# EAGLE design MAX1555_breakout (EAGLE 5.06)
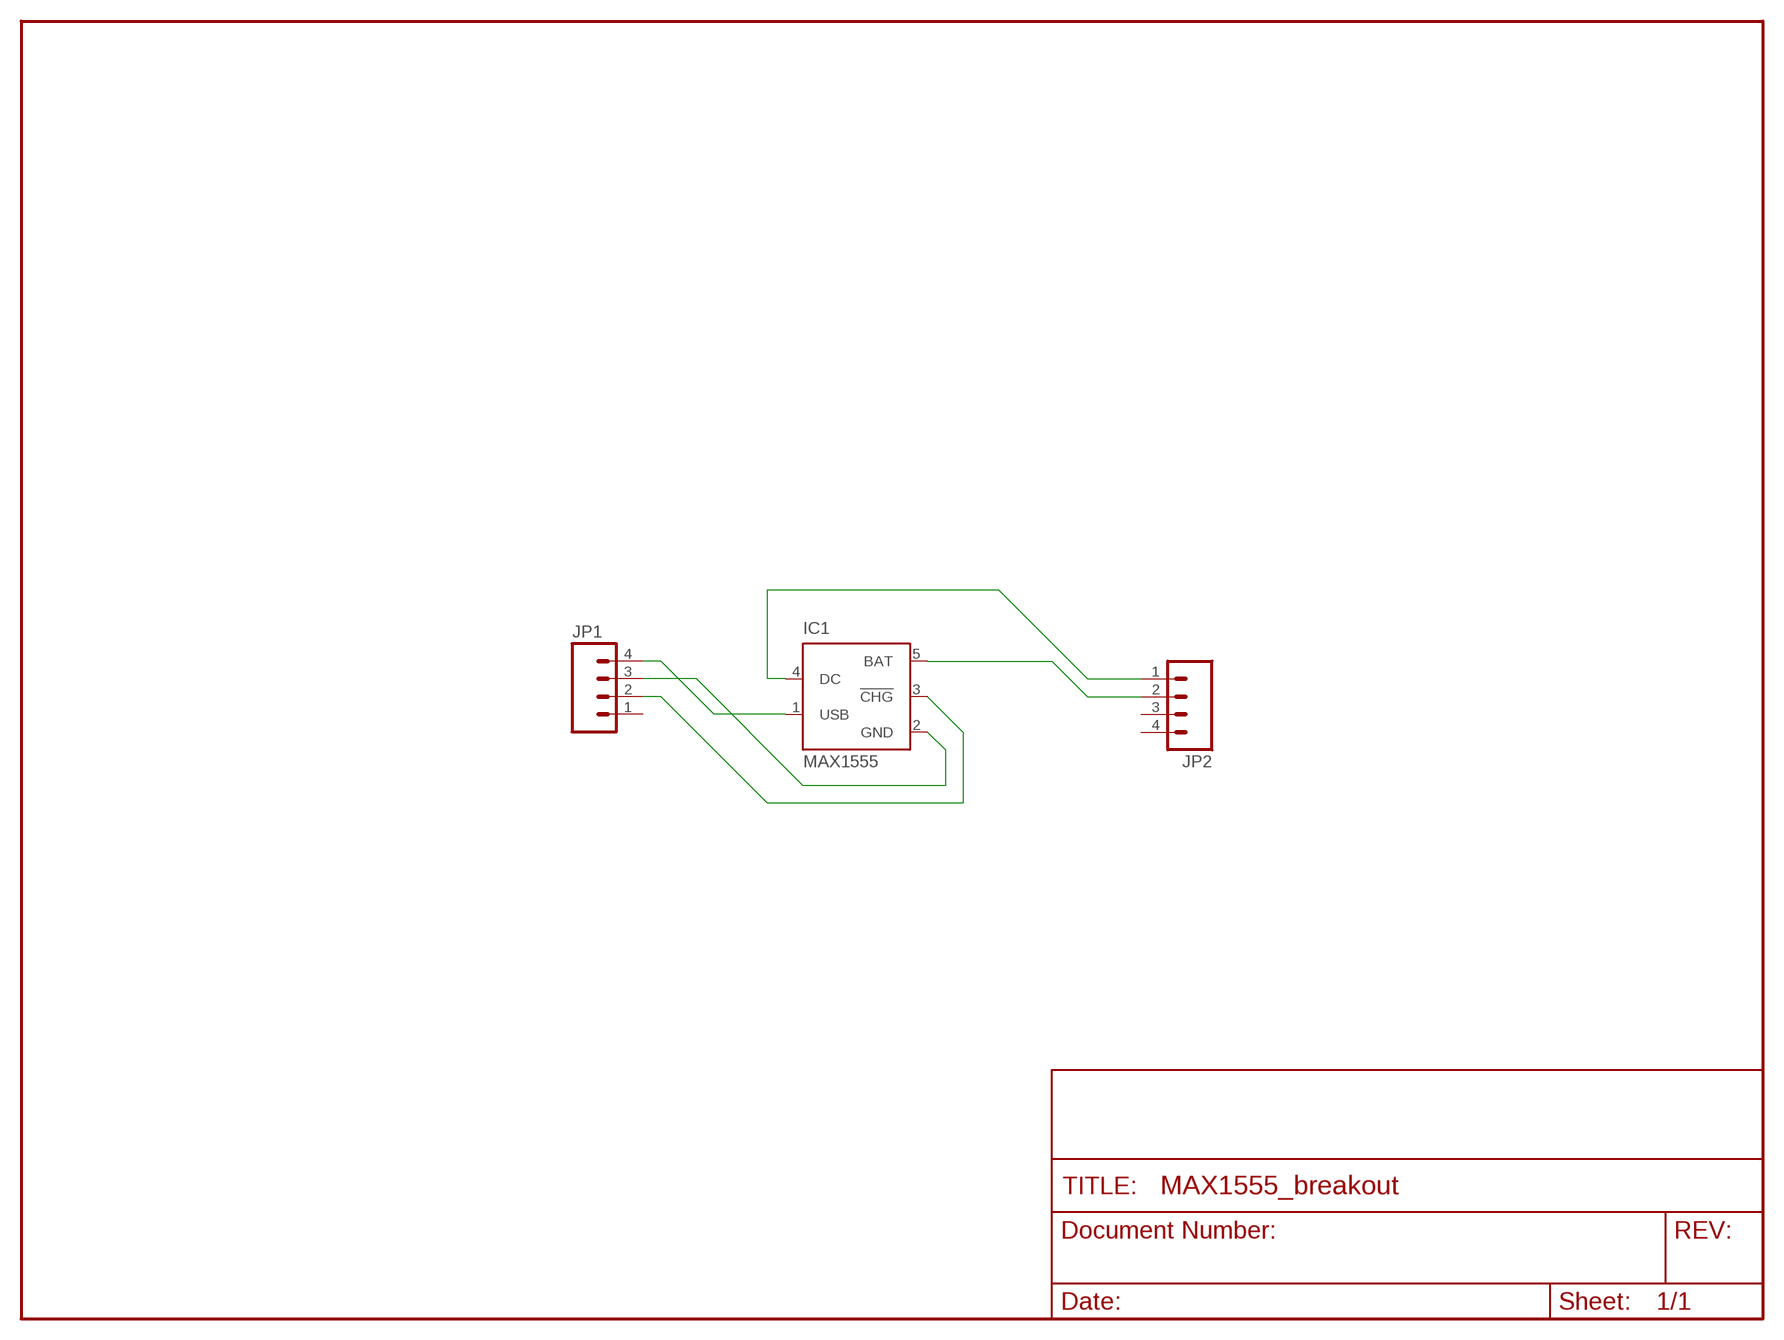
[diagram p0: schematic, sheet 1]

## Parts
IC1  MAX1555  [SOT23-5L]
JP1  M04LOCK  [1X04_LOCK]
JP2  M04LOCK  [1X04_LOCK]

## Nets
N$1: IC1.1(USB) JP1.4
N$2: IC1.2(GND) JP1.3
N$3: IC1.3(!CHG) JP1.2
N$4: IC1.4(DC) JP2.1
N$5: IC1.5(BAT) JP2.2
Unconnected: JP1.1 JP2.3 JP2.4

## Library data of the parts
IC1 = maxim:MAX1555: Dual-Input USB/AC Adapter 1-Cell Li+ Battery Chargers Source: http://www.maxim-ic.com .. MAX1551-MAX1555.pdf
JP1 JP2 = SparkFun:M04: Header 4 Standard 4-pin 0.1" header. Use with straight break away headers (SKU : PRT-00116), right angle break away headers (PRT-00553), swiss pins (PRT-00743), machine pins (PRT-00117), and female headers (PRT-00115). Molex polarized connector foot print use with SKU : PRT-08231 with associated crimp pins and housings.

## Board
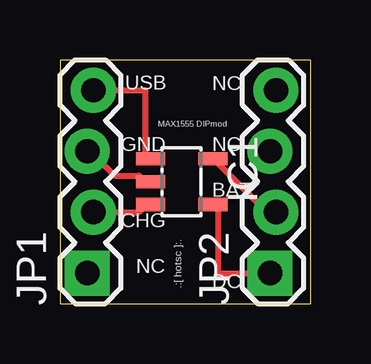
[diagram p1: board, top side]

Size 10.46 x 10.15 mm. Coordinates in mm from the lower left corner, seen from the top.
Outline: 0,0 10.46,0 10.46,10.15 0,10.15 0,0
Copper layers (1*16): Top 0.035mm / dielectric 1.5mm / Bottom 0.035mm
Design rules "default": minimum track width 10mil, minimum drill 24mil, track to track 8mil, track to pad 8mil, pad to pad 8mil, via to via 8mil, smd to smd 8mil, copper to edge 40mil, drill to drill 8mil, minimum pad ring 10mil, minimum via ring 8mil, stop-mask expansion 4mil, vias tented up to drill 0mil, thermal gap 10mil

### Footprints (pad centres in the part's own frame; a part is rotated, then mirrored left to right if it is on the bottom)
SOT23-5L = smd 0.55 x 1.2: 1 -0.95,-1.3; 2 0,-1.3; 3 0.95,-1.3; 4 0.95,1.3; 5 -0.95,1.3
1X04_LOCK = drill 1.016 pad 1.88 square: 1 0,0.127 | drill 1.016 pad 1.88 round: 2 2.54,-0.127; 3 5.08,0.127; 4 7.62,-0.127

### Placement (x,y rotation side)
IC1  5.08,5.08 270 top
JP1  1.27,1.27 90 top
JP2  8.89,1.27 90 top

### Tracks (layer width: path | path; a pad name or v marks a point on that pad's centre or on a via)
N$1
  Top 0.254: IC1.1 3.56,6.1 3.56,8.89 JP1.4
N$2
  Top 0.254: IC1.2 3.56,5.08 3.3,5.33 2.29,5.33 1.27,6.35 JP1.3
N$3
  Top 0.254: IC1.3 3.56,4.06 3.3,3.81 JP1.2
N$4
  Top 0.254: IC1.4 6.6,4.06 6.6,1.27 JP2.1
N$5
  Top 0.254: IC1.5 6.6,5.84 8.64,3.81 JP2.2

### Text on the board
tPlace: USB | NC | MAX1555 DIPmod | GND | NC | BAT | CHG | NC | .:[ hotsc ]:. | DC